# EAGLE schematic ppg_array_wireless (EAGLE 9.4.2)
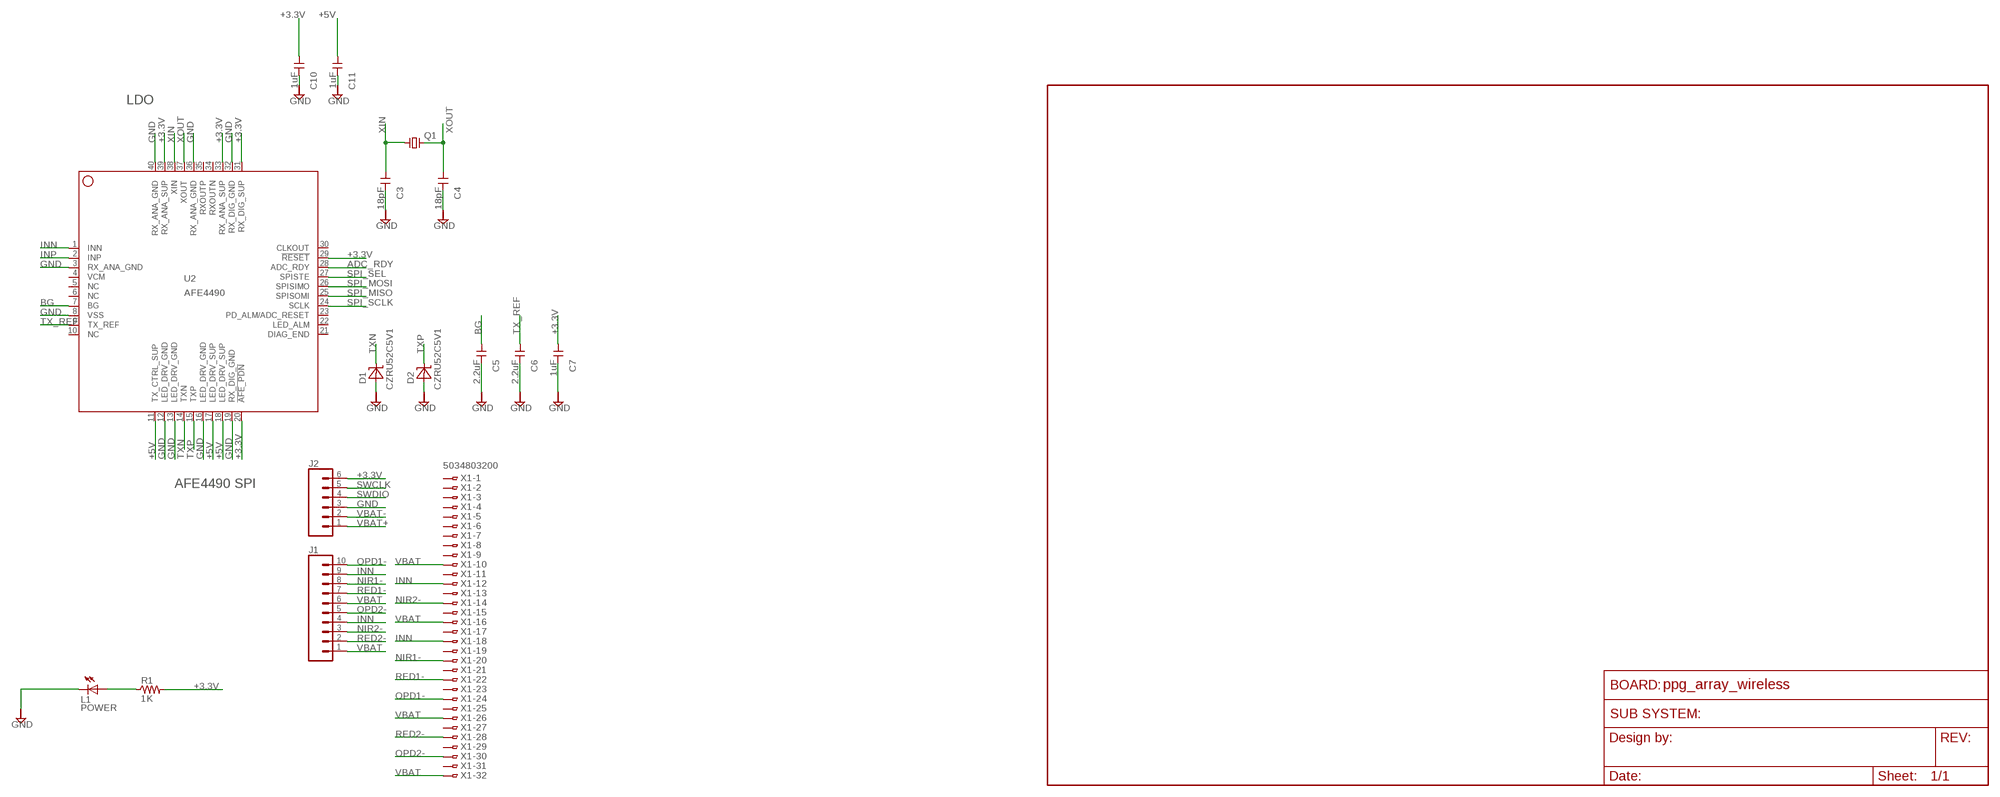
[diagram p0: schematic, sheet 1]

## Parts
C3  18pF  CAP0603-CAP  [0603-CAP]
C4  18pF  CAP0603-CAP  [0603-CAP]
C5  2.2uF  CAP0603-CAP  [0603-CAP]
C6  2.2uF  CAP0603-CAP  [0603-CAP]
C7  1uF  CAP0603-CAP  [0603-CAP]
C10  1uF  CAP0603-CAP  [0603-CAP]
C11  1uF  CAP0603-CAP  [0603-CAP]
D1  CZRU52C5V1  [CZRU52C5V1]
D2  CZRU52C5V1  [CZRU52C5V1]
J1  CONN_10"  [1X10]
J2  CONN_06SILK_FEMALE_PTH  [1X06]
L1  POWER  LEDCHIP-LED0603  [CHIP-LED0603]
Q1  CRYSTAL_ECS_8MHZ  [XTAL_ECS-80-18-5PX-TR]
R1  1K  R-US_R0603  [R0603]
U2  AFE4490  [QFN40-6X6]
X1  5034803200  [5034803200]

## Nets
+3.3V: C7.1 C10.1 J2.6 R1.2 U2.20(!AFE_PDN) U2.29(!RESET) U2.31(RX_DIG_SUP) U2.33(RX_ANA_SUP) U2.39(RX_ANA_SUP)
+5V: C11.1 U2.11(TX_CTRL_SUP) U2.17(LED_DRV_SUP) U2.18(LED_DRV_SUP)
ADC_RDY: U2.28(ADC_RDY)
BG: C5.1 U2.7(BG)
GND: C3.2 C4.2 C5.2 C6.2 C7.2 C10.2 C11.2 D1.A D2.A J2.3 L1.C U2.3(RX_ANA_GND) U2.8(VSS) U2.12(LED_DRV_GND) U2.13(LED_DRV_GND) U2.16(LED_DRV_GND) U2.19(RX_DIG_GND) U2.32(RX_DIG_GND) U2.36(RX_ANA_GND) U2.40(RX_ANA_GND)
INN: J1.4 J1.9 U2.1(INN) X1.12 X1.18
INP: U2.2(INP)
N$1: L1.A R1.1
NIR1-: J1.8 X1.20
NIR2-: J1.3 X1.14
OPD1-: J1.10 X1.24
OPD2-: J1.5 X1.30
RED1-: J1.7 X1.22
RED2-: J1.2 X1.28
SPI_MISO: U2.25(SPISOMI)
SPI_MOSI: U2.26(SPISIMO)
SPI_SCLK: U2.24(SCLK)
SPI_SEL: U2.27(SPISTE)
SWCLK: J2.5
SWDIO: J2.4
TX_REF: C6.1 U2.9(TX_REF)
TXN: D1.C U2.14(TXN)
TXP: D2.C U2.15(TXP)
VBAT: J1.1 J1.6 X1.10 X1.16 X1.26 X1.32
VBAT+: J2.1
VBAT-: J2.2
XIN: C3.1 Q1.1(A) U2.38(XIN)
XOUT: C4.1 Q1.2(B) U2.37(XOUT)
Unconnected: U2.4(VCM) U2.5(NC) U2.6(NC) U2.10(NC) U2.21(DIAG_END) U2.22(LED_ALM) U2.23(PD_ALM/ADC_RESET) U2.30(CLKOUT) U2.34(RXOUTN) U2.35(RXOUTP) X1.1 X1.2 X1.3 X1.4 X1.5 X1.6 X1.7 X1.8 X1.9 X1.11 X1.13 X1.15 X1.17 X1.19 X1.21 X1.23 X1.25 X1.27 X1.29 X1.31

## Notes on the sheet
- LDO
- AFE4490 SPI

## Power pins joined to a net without a drawn wire
GND: U2.EXP@1(GND) U2.EXP@2(GND) U2.EXP@3(GND) U2.EXP@4(GND) U2.EXP@5(GND) U2.EXP@6(GND) U2.EXP@7(GND) U2.EXP@8(GND) U2.EXP@9(GND) U2.EXP@10(GND) U2.EXP@11(GND) U2.EXP@12(GND) U2.EXP@13(GND) U2.EXP@14(GND) U2.EXP@15(GND) U2.EXP@16(GND) U2.PWR@1(GND) U2.PWR@2(GND)

## Library data of the parts
C3-C7 C10 C11 = scono:CAP: Capacitor Standard 0603 ceramic capacitor, and 0.1" leaded capacitor.; PIE-INT-REF-NUM: CAPACITOR-GENERIC
D1 D2 = diode:CZRU52C5V1
J1 = SparkFun-Connectors:CONN_10: Multi connection point. Often used as Generic Header-pin footprint for 0.1 inch spaced/style header connections On any of the 0.1 inch spaced packages, you can populate with these: Break Away Headers - Straight <https://www.sparkfun.com/products/116> (PRT-00116) Break Away Male Headers - Right Angle <https://www.sparkfun.com/products/553> (PRT-00553) Female Headers <https://www.sparkfun.com/products/115> (PRT-00115) Break Away Headers - Machine Pin <https://www.sparkfun.com/products/117> (PRT-00117) Break Away Female Headers - Swiss Machine Pin <https://www.sparkfun.com/products/743> (PRT-00743) Arduino Stackable Header - 10 Pin <https://www.sparkfun.com/products/11376> (PRT-11376) For SCREWTERMINALS and SPRING TERMINALS visit here: Screw Terimnals on SparkFun.com <https://www.sparkfun.com/search/results?term=Screw+Terminals> (5mm/3.5mm/2.54mm spacing) This device is also useful as a general connection point to wire up your design to another part of your project. Our various solder wires solder well into these plated through hole pads. Hook-Up Wire - Assortment (Stranded, 22 AWG) <https://www.sparkfun.com/products/11375> (PRT-11375) Hook-Up Wire - Assortment (Solid Core, 22 AWG) <https://www.sparkfun.com/products/11367> (PRT-11367) View the entire wire category on our website here <https://www.sparkfun.com/categories/141> Special notes: Molex polarized connector foot print use with SKU : PRT-08231 with associated crimp pins and housings. 1MM SMD Version SKU: PRT-10208 NOTES ON THE VARIANTS LOCK and LOCK_LONGPADS... This footprint was designed to help hold the alignment of a through-hole component (i.e. 6-pin header) while soldering it into place. You may notice that each hole has been shifted either up or down by 0.005 of an inch from it's more standard position (which is a perfectly straight line). This slight alteration caused the pins (the squares in the middle) to touch the edges of the holes. Because they are alternating, it causes a "brace" to hold the component in place. 0.005 has proven to be the perfect amount of "off-center" position when using our standard breakaway headers. Although looks a little odd when you look at the bare footprint, once you have a header in there, the alteration is very hard to notice. Also,if you push a header all the way into place, it is covered up entirely on the bottom side.; PROD_ID: CONN-11563
J2 = SparkFun-Connectors:CONN_06: Multi connection point. Often used as Generic Header-pin footprint for 0.1 inch spaced/style header connections On any of the 0.1 inch spaced packages, you can populate with these: Break Away Headers - Straight <https://www.sparkfun.com/products/116> (PRT-00116) Break Away Male Headers - Right Angle <https://www.sparkfun.com/products/553> (PRT-00553) Female Headers <https://www.sparkfun.com/products/115> (PRT-00115) Break Away Headers - Machine Pin <https://www.sparkfun.com/products/117> (PRT-00117) Break Away Female Headers - Swiss Machine Pin <https://www.sparkfun.com/products/743> (PRT-00743) Arduino Stackable Header - 6 Pin <https://www.sparkfun.com/products/9280> (PRT-09280) For SCREWTERMINALS and SPRING TERMINALS visit here: Screw Terimnals on SparkFun.com <https://www.sparkfun.com/search/results?term=Screw+Terminals> (5mm/3.5mm/2.54mm spacing) This device is also useful as a general connection point to wire up your design to another part of your project. Our various solder wires solder well into these plated through hole pads. Hook-Up Wire - Assortment (Stranded, 22 AWG) <https://www.sparkfun.com/products/11375> (PRT-11375) Hook-Up Wire - Assortment (Solid Core, 22 AWG) <https://www.sparkfun.com/products/11367> (PRT-11367) View the entire wire category on our website here <https://www.sparkfun.com/categories/141>; PROD_ID: CONN-08437
L1 = led:LED: LED OSRAM: - CHIPLED LG R971, LG N971, LY N971, LG Q971, LY Q971, LO R971, LY R971 LH N974, LH R974 LS Q976, LO Q976, LY Q976 LO Q996 - Hyper CHIPLED LW Q18S LB Q993, LB Q99A, LB R99A - SideLED LS A670, LO A670, LY A670, LG A670, LP A670 LB A673, LV A673, LT A673, LW A673 LH A674 LY A675 LS A676, LA A676, LO A676, LY A676, LW A676 LS A679, LY A679, LG A679 - Hyper Micro SIDELED® LS Y876, LA Y876, LO Y876, LY Y876 LT Y87S - SmartLED LW L88C, LW L88S LB L89C, LB L89S, LG L890 LS L89K, LO L89K, LY L89K LS L896, LA L896, LO L896, LY L896 - TOPLED LS T670, LO T670, LY T670, LG T670, LP T670 LSG T670, LSP T670, LSY T670, LOP T670, LYG T670 LG T671, LOG T671, LSG T671 LB T673, LV T673, LT T673, LW T673 LH T674 LS T676, LA T676, LO T676, LY T676, LB T676, LH T676, LSB T676, LW T676 LB T67C, LV T67C, LT T67C, LS T67K, LO T67K, LY T67K, LW E67C LS E67B, LA E67B, LO E67B, LY E67B, LB E67C, LV E67C, LT E67C LW T67C LS T679, LY T679, LG T679 LS T770, LO T770, LY T770, LG T770, LP T770 LB T773, LV T773, LT T773, LW T773 LH T774 LS E675, LA E675, LY E675, LS T675 LS T776, LA T776, LO T776, LY T776, LB T776 LHGB T686 LT T68C, LB T68C - Hyper Mini TOPLED® LB M676 - Mini TOPLED Santana® LG M470 LS M47K, LO M47K, LY M47K Source: http://www.osram.convergy.de LUXEON: - LUMILED® LXK2-PW12-R00, LXK2-PW12-S00, LXK2-PW14-U00, LXK2-PW14-V00 LXK2-PM12-R00, LXK2-PM12-S00, LXK2-PM14-U00 LXK2-PE12-Q00, LXK2-PE12-R00, LXK2-PE12-S00, LXK2-PE14-T00, LXK2-PE14-U00 LXK2-PB12-K00, LXK2-PB12-L00, LXK2-PB12-M00, LXK2-PB14-N00, LXK2-PB14-P00, LXK2-PB14-Q00 LXK2-PR12-L00, LXK2-PR12-M00, LXK2-PR14-Q00, LXK2-PR14-R00 LXK2-PD12-Q00, LXK2-PD12-R00, LXK2-PD12-S00 LXK2-PH12-R00, LXK2-PH12-S00 LXK2-PL12-P00, LXK2-PL12-Q00, LXK2-PL12-R00 Source: www.luxeon.com KINGBRIGHT: KA-3528ASYC Source: www.kingbright.com
Q1 = scono:CRYSTAL
R1 = scono:R-US_: RESISTOR, American symbol; DESCRIPTION: RESISTOR, American symbol; DISTRIBUTOR: DigiKey; MANUFACTURER: Rohm Semiconductor; NOTES: Cut Tape; PACKAGE: R0603
U2 = AFE4490:AFE4490
X1 = con-hirose:5034803200: 0.5mm Pitch Connectors For FPC/FFC Source: Data sheet <http://www.hirose.co.jp/cataloge_hp/e58605370.pdf>